# EAGLE design Ethernet POrts (EAGLE 8.5.0)
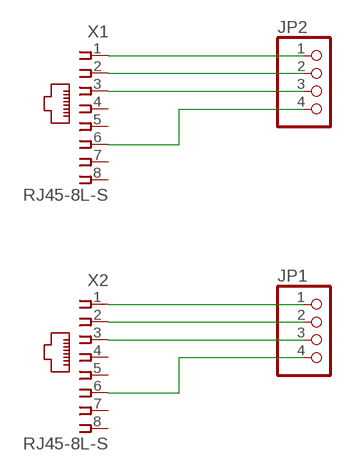
[diagram p0: schematic, sheet 1]

## Parts
JP1  PINHD-1X4  [1X04]
JP2  PINHD-1X4  [1X04]
X1  RJ45-8L-S  [RJ45-NO-SHIELD]
X2  RJ45-8L-S  [RJ45-NO-SHIELD]

## Nets
N$1: JP2.1 X1.1
N$2: JP2.2 X1.2
N$3: JP2.3 X1.3
N$4: JP2.4 X1.6
N$5: JP1.1 X2.1
N$6: JP1.2 X2.2
N$7: JP1.3 X2.3
N$8: JP1.4 X2.6
Unconnected: X1.4 X1.5 X1.7 X1.8 X2.4 X2.5 X2.7 X2.8

## Library data of the parts
JP1 JP2 = pinhead:PINHD-1X4: PIN HEADER
X1 X2 = con-tycoelectronics:RJ45: CORCOM Modular RJ Jacks No Shield Source: www.tycoelectronics.com .. ENG_DS_1654001_1099_RJ_L_0507.pdf; MF: TYCO ELECTRONICS; MPN: RJ45-8L-S; OC_FARNELL: unknown; OC_NEWARK: 80K9067

## Board
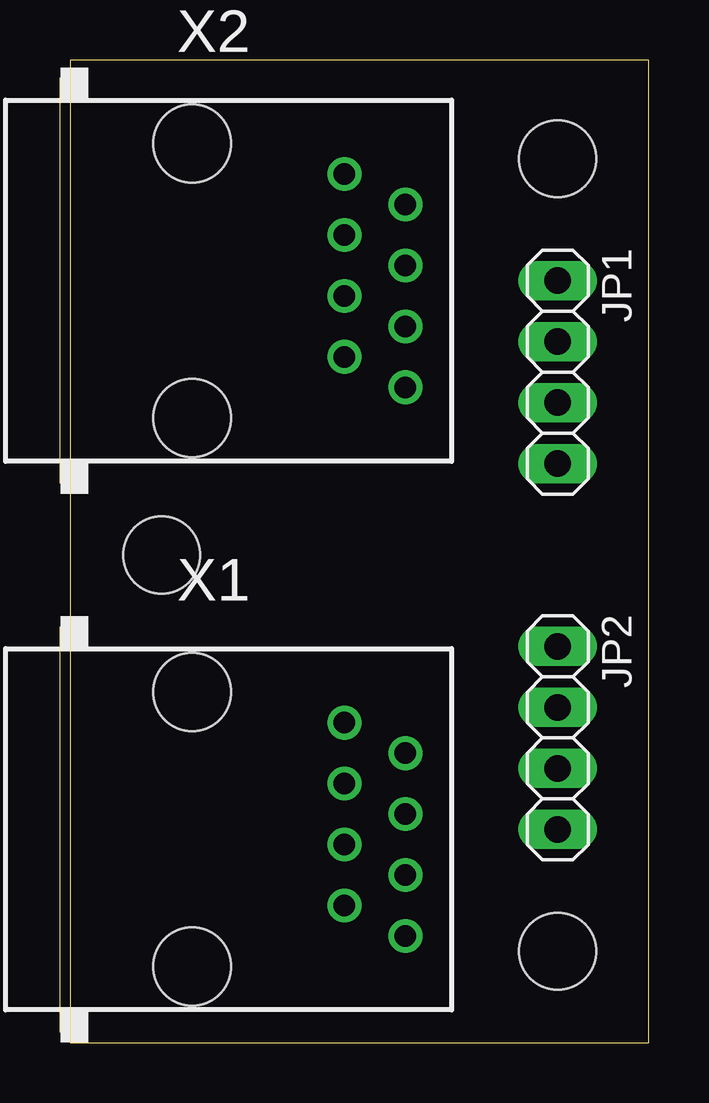
[diagram p1: board, top side]
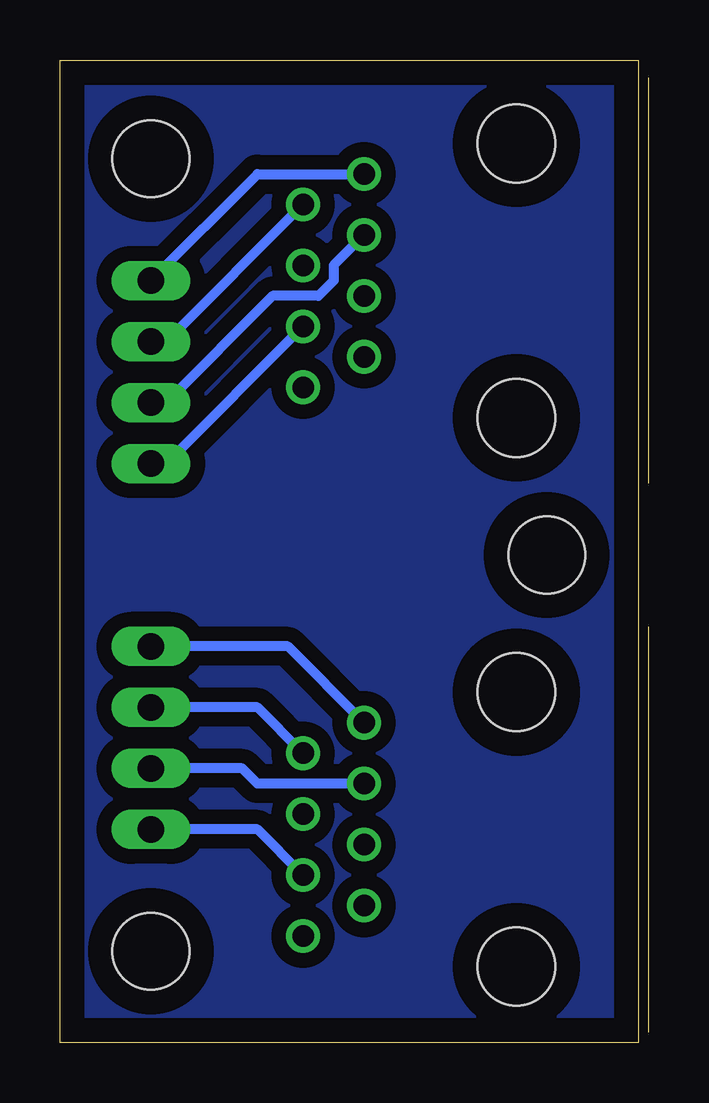
[diagram p2: board, bottom side, seen from below]

Size 24.11 x 40.95 mm. Coordinates in mm from the lower left corner, seen from the top.
Outline: 0,0 24.11,0 24.11,40.95 0,40.95 0,0
Copper layers (1*16): Top 0.035mm / dielectric 1.5mm / Bottom 0.035mm
Design rules "default": minimum track width 6mil, minimum drill 0.35mm, track to track 6mil, track to pad 6mil, pad to pad 6mil, via to via 6mil, smd to smd 6mil, copper to edge 40mil, drill to drill 6mil, minimum pad ring 10mil, minimum via ring 8mil, stop-mask expansion 4mil, vias tented up to drill 0mil, thermal gap 10mil
Holes 3.2 mm at 3.81,20.32 20.32,36.83 20.32,3.81

### Footprints (pad centres in the part's own frame; a part is rotated, then mirrored left to right if it is on the bottom)
1X04 = drill 1.1 long: 1 -3.81,0; 2 -1.27,0; 3 1.27,0; 4 3.81,0
RJ45-NO-SHIELD = drill 0.9 pad 1.4: 1 -4.445,6.35; 2 -3.175,8.89; 3 -1.905,6.35; 4 -0.635,8.89; 5 0.635,6.35; 6 1.905,8.89; 7 3.175,6.35; 8 4.445,8.89 | hole 3.251: -5.715,0; 5.715,0

### Placement (x,y rotation side)
JP1  20.32,27.94 270 top
JP2  20.32,12.7 270 top
X1  5.08,8.89 270 top
X2  5.08,31.75 270 top

### Tracks (layer width: path | path; a pad name or v marks a point on that pad's centre or on a via)
N$1
  Bottom 0.406: X1.1 14.61,16.51 JP2.1
N$2
  Bottom 0.406: X1.2 15.88,13.97 JP2.2
N$3
  Bottom 0.406: X1.3 15.88,10.79 16.51,11.43 JP2.3
N$4
  Bottom 0.406: X1.6 15.88,8.89 JP2.4
N$5
  Bottom 0.406: JP1.1 15.88,36.2 X2.1
N$6
  Bottom 0.406: X2.2 19.68,29.21 JP1.2
N$7
  Bottom 0.406: X2.3 12.7,32.38 12.7,31.75 13.34,31.11 15.24,31.11 19.68,26.67 JP1.3
N$8
  Bottom 0.406: X2.6 19.68,24.13 JP1.4
N$9
  pour Bottom (isolate 0.61): 0,40.64 24.13,40.64 24.13,0 0,0